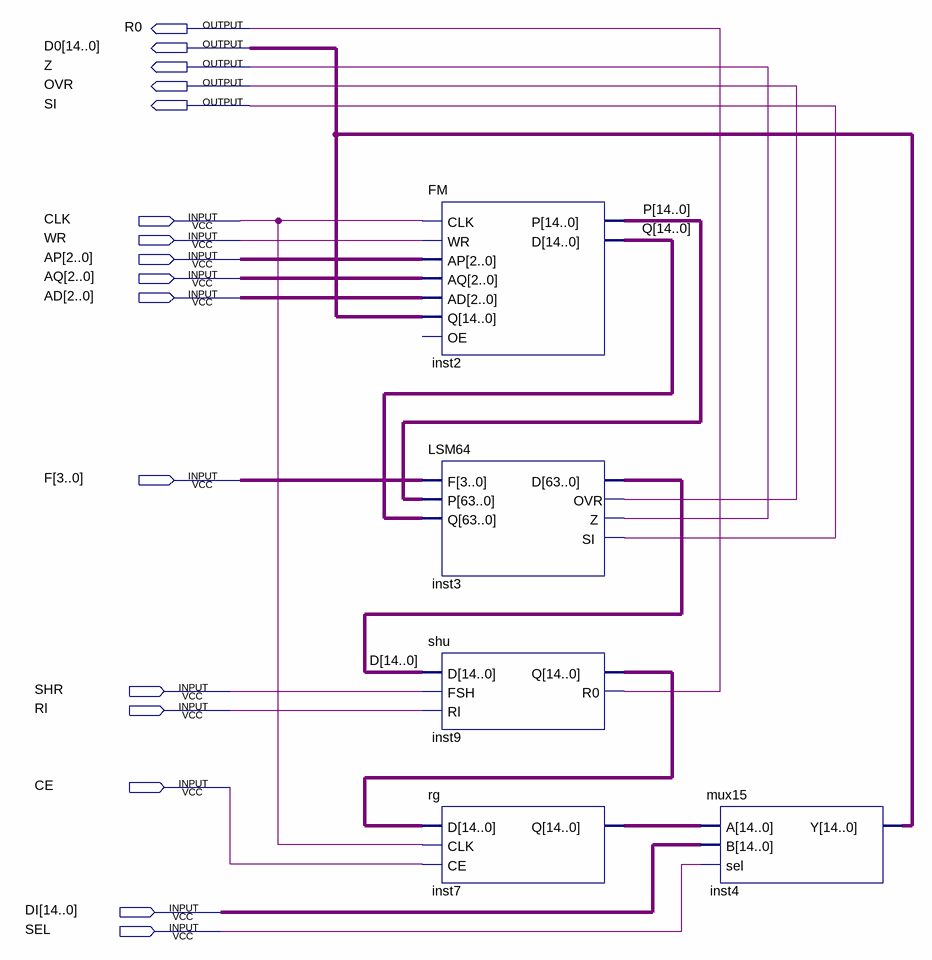
[diagram p0: schematic sheet]
// Quartus schematic au.bdf as structural Verilog: 5 symbols, 16 pins
module au (
  input  CLK,
  input  WR,
  input  [2:0] AP,
  input  [2:0] AQ,
  input  [2:0] AD,
  input  [3:0] F,
  input  SHR,
  input  Rl,
  input  CE,
  input  [14:0] DI,
  input  SEL,
  output R0,
  output [14:0] D0,
  output Z,
  output OVR,
  output SI
);

  wire [14:0] D, inst7_q, inst9_q, P, Q;

  FM inst2 (.CLK(CLK), .WR(WR), .AP(AP), .AQ(AQ), .AD(AD), .Q(D0), .P(P), .D(Q));  // open: OE
  LSM64 inst3 (.F(F), .P(P), .Q(Q), .D(D), .OVR(OVR), .Z(Z), .SI(SI));
  shu inst9 (.D(D), .FSH(SHR), .Rl(Rl), .Q(inst9_q), .R0(R0));
  rg inst7 (.D(inst9_q), .CLK(CLK), .CE(CE), .Q(inst7_q));
  mux15 inst4 (.A(inst7_q), .B(DI), .sel(SEL), .Y(D0));
endmodule
